# EAGLE design room-therm (EAGLE 7.6.0)
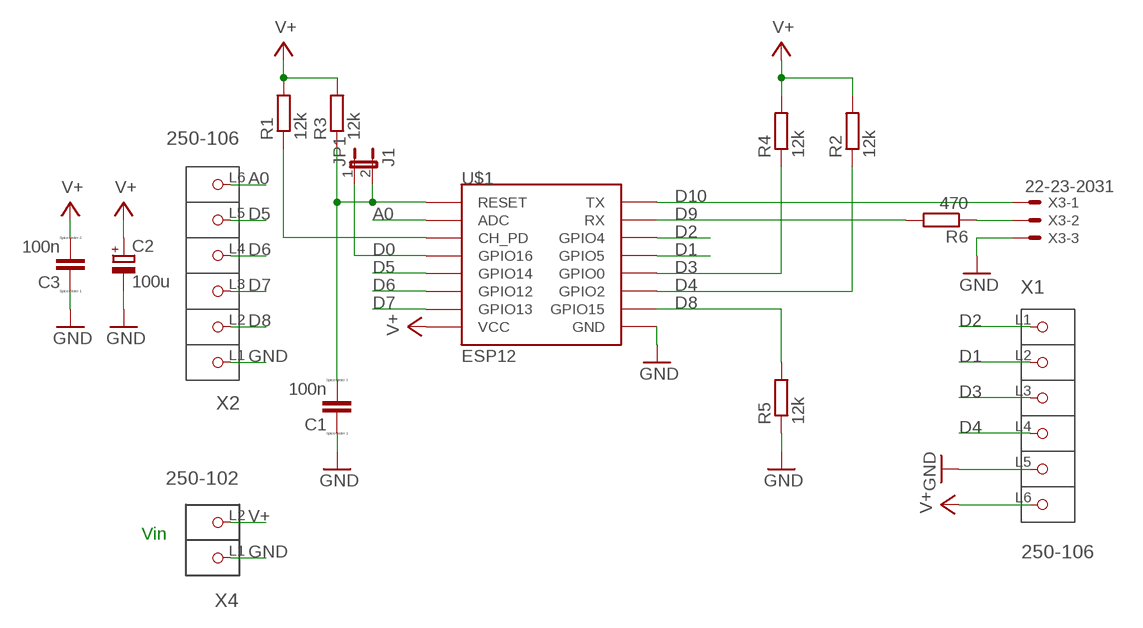
[diagram p0: schematic, sheet 1]

## Parts
C1  100n  CC1005  [C1005]
C2  100u  CPOL-EUE2-4  [E2-4]
C3  100n  CC1005  [C1005]
JP1  J1  JP1E  [JP1]
R1  12k  R-EU_R0805  [R0805]
R2  12k  R-EU_R0805  [R0805]
R3  12k  R-EU_R0805  [R0805]
R4  12k  R-EU_R0805  [R0805]
R5  12k  R-EU_R0805  [R0805]
R6  470  R-EU_R0805  [R0805]
U$1  ESP12  [ESP12]
X1  250-106  [P-250-106]
X2  250-106  [P-250-106]
X3  22-23-2031  [22-23-2031]
X4  250-102  [P-250-102]

## Nets
A0: U$1.ADC X2.L6(P6)
D0: JP1.1 U$1.GPIO16
D1: U$1.GPIO5 X1.L2(P2)
D2: U$1.GPIO4 X1.L1(P1)
D3: R4.1 U$1.GPIO0 X1.L3(P3)
D4: R2.1 U$1.GPIO2 X1.L4(P4)
D5: U$1.GPIO14 X2.L5(P5)
D6: U$1.GPIO12 X2.L4(P4)
D7: U$1.GPIO13 X2.L3(P3)
D8: R5.2 U$1.GPIO15 X2.L2(P2)
D9: R6.2 U$1.RX
D10: U$1.TX X3.1
GND: C1.1 C2.- C3.1 R5.1 U$1.GND X1.L5(P5) X2.L1(P1) X3.3 X4.L1(P1)
N$3: C1.2 JP1.2 R3.1 U$1.RESET
N$4: R1.1 U$1.CH_PD
N$7: R6.1 X3.2
V+: C2.+ C3.2 R1.2 R2.2 R3.2 R4.2 U$1.VCC X1.L6(P6) X4.L2(P2)

## Notes on the sheet
- Vin

## Library data of the parts
C1 C3 = eagle-ltspice:C: CAPACITOR, European symbol; SPICEMODEL: NONE; SPICEPREFIX: C
C2 = resistor:CPOL-EU: POLARIZED CAPACITOR, European symbol
JP1 = jumper:JP1E: JUMPER
R1-R6 = rcl:R-EU_: RESISTOR, European symbol
U$1 = esp8266modules:ESP12: ESP8266 Wifi module 12
X1 X2 = con-wago_250:250-106: Serie 250, 1-Leiter-Klemmenleiste für Leiterplatten 1 Lötstift/Pol vorn / Series 250, 1-conductor PCB terminal strip 1 front solder pin/pole Polzahl / Pole No.: 6 Rastermaß / Pitch: 3.5 mm Bemessungsspannung / Rated Voltage: 160 V Nennstrom / Nominal Current: 8 A Leiterquerschnitt / Conductor Size: 0.2 - 1.5 mm² Anschlusstechnik / Connection Technology: Steckklemm-Anschluss Lötstiftlänge: / Solder Pin Length: 3.6 mm Leitereinführung (zur Platine) / Conductor entry angle (to PCB): 45 ° Farbe / Color: grau / gray Stand: 01.01.2012. Die jeweils aktuellen Daten zu diesem Artikel finden Sie in unserem Produktkatalog, den Sie unter www.wago.com einsehen können. As of: 01/01/2012. Please find the newest data for this article in our product catalogue, which can be viewed under www.wago.com.
X3 = con-molex:22-23-2031: .100" (2.54mm) Center Header - 3 Pin; MF: MOLEX; MPN: 22-23-2031; OC_FARNELL: 1462950; OC_NEWARK: 30C0862
X4 = con-wago_250:250-102: Serie 250, 1-Leiter-Klemmenleiste für Leiterplatten 1 Lötstift/Pol vorn / Series 250, 1-conductor PCB terminal strip 1 front solder pin/pole Polzahl / Pole No.: 2 Rastermaß / Pitch: 3.5 mm Bemessungsspannung / Rated Voltage: 160 V Nennstrom / Nominal Current: 8 A Leiterquerschnitt / Conductor Size: 0.2 - 1.5 mm² Anschlusstechnik / Connection Technology: Steckklemm-Anschluss Lötstiftlänge: / Solder Pin Length: 3.6 mm Leitereinführung (zur Platine) / Conductor entry angle (to PCB): 45 ° Farbe / Color: grau / gray Stand: 01.01.2012. Die jeweils aktuellen Daten zu diesem Artikel finden Sie in unserem Produktkatalog, den Sie unter www.wago.com einsehen können. As of: 01/01/2012. Please find the newest data for this article in our product catalogue, which can be viewed under www.wago.com.

## Board
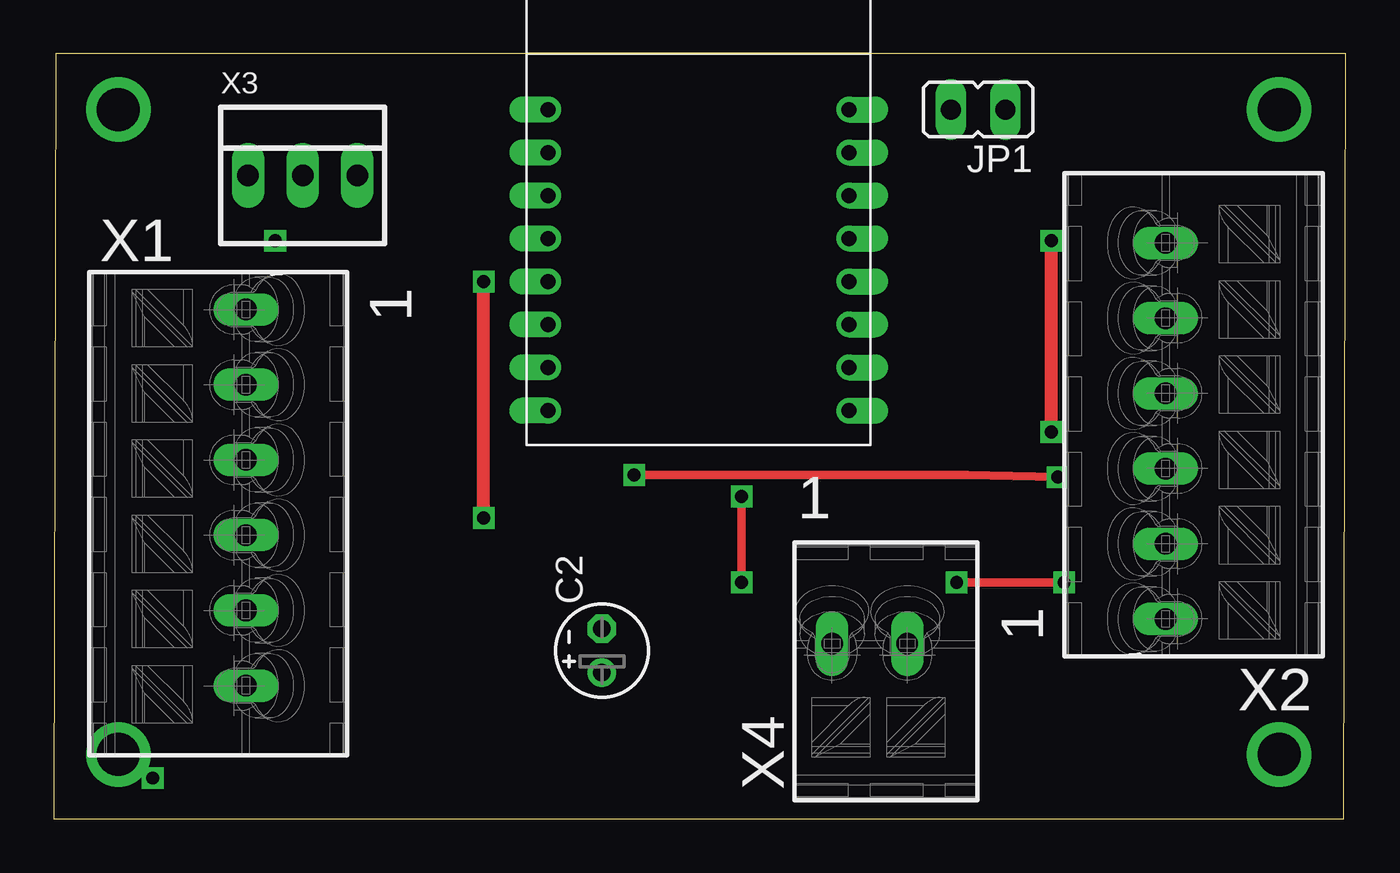
[diagram p1: board, top side]
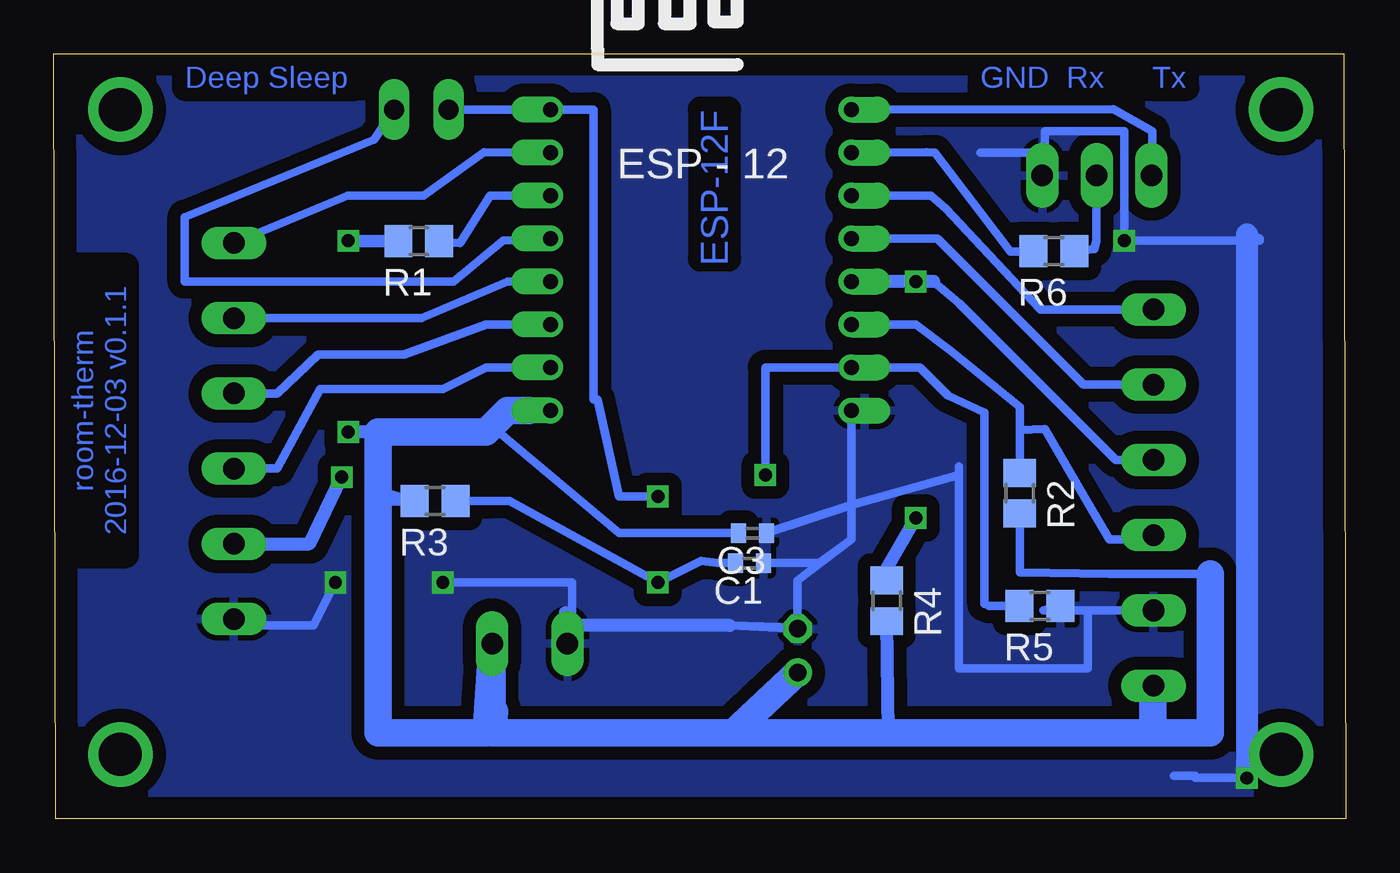
[diagram p2: board, bottom side, seen from below]

Size 60.1 x 35.6 mm. Coordinates in mm from the lower left corner, seen from the top.
Outline: 0,0 60,0 60.1,35.6 0.1,35.6 0,0
Copper layers (1*16): Top 0.035mm / dielectric 1.5mm / Bottom 0.035mm
Design rules "default *": minimum track width 10mil, minimum drill 0.5mm, track to track 8mil, track to pad 8mil, pad to pad 8mil, via to via 8mil, smd to smd 8mil, copper to edge 40mil, drill to drill 8mil, minimum pad ring 10mil, minimum via ring 8mil, stop-mask expansion 4mil, vias tented up to drill 0mil, thermal gap 10mil

### Footprints (pad centres in the part's own frame; a part is rotated, then mirrored left to right if it is on the bottom)
C1005 = smd 0.7 x 0.9: 1 -0.65,0; 2 0.65,0
E2-4 = drill 0.813 pad 1.27: + -1.016,0 | drill 0.813 pad 1.27 octagon: - 1.016,0
JP1 = drill 0.914 long: 1 0,-1.27; 2 0,1.27
R0805 = smd 1.3 x 1.5: 1 -0.95,0; 2 0.95,0
ESP12 = drill 0.7 offset: ADC -7.1,3.8; CH_PD -7.1,1.8; GND 6.9,-8.2; GPIO0 6.9,-2.2; GPIO2 6.9,-4.2; GPIO4 6.9,1.8; GPIO5 6.9,-0.2; GPIO12 -7.1,-4.2; GPIO13 -7.1,-6.2; GPIO14 -7.1,-2.2; GPIO15 6.9,-6.2; GPIO16 -7.1,-0.2; RESET -7.1,5.8; RX 6.9,3.8; TX 6.9,5.8; VCC -7.1,-8.2
P-250-106 = drill 1 long: L1 1.3,9.5; L2 1.3,6; L3 1.3,2.5; L4 1.3,-1; L5 1.3,-4.5; L6 1.3,-8
22-23-2031 = drill 1 long: 1 -2.54,0; 2 0,0; 3 2.54,0
P-250-102 = drill 1 long: L1 1.3,2.5; L2 1.3,-1

### Placement (x,y rotation side)
C1  27.74,11.9 180 bottom
C2  25.5,7.83 90 top
C3  27.6,13.3 180 bottom
JP1  43,33 90 top
R1  43.12,26.88 180 bottom
R2  15.17,15.15 270 bottom
R3  42.36,14.79 180 bottom
R4  21.36,10.15 270 bottom
R5  14.23,9.91 180 bottom
R6  13.58,26.42 180 bottom
U$1  29.9,27.2 0 bottom
X1  7.64,14.2 0 top
X2  53.02,18.8 180 top
X3  11.58,29.93 0 top
X4  38.71,6.86 90 top

### Tracks (layer width: path | path; a pad name or v marks a point on that pad's centre or on a via)
A0
  Bottom 0.406: U$1.ADC 40.09,31.01 42.9,29 46.42,29 X2.L6
D0
  Bottom 0.406: U$1.GPIO16 39.2,26.9 41.5,25 54,25 54,28 45.2,31.6 JP1.1
D1
  Bottom 0.406: X1.L2 12.2,20.2 19,27 U$1.GPIO5
D2
  Bottom 0.406: X1.L1 14.2,23.7 18.6,28.4 19.3,29 U$1.GPIO4
D3  (via drill 0.6)
  Top 0.61: v20,14 v20,25
  Bottom 0.406: X1.L3 10.7,16.7 18,24 19.17,25 | R4.1 21.36,11.64
  Bottom 0.61: 21.36,11.64 v20,14 | U$1.GPIO0 v20,25 19.17,25
D4
  Bottom 0.406: X1.L4 8.94,13.06 9,13 11,13 12,14.7 14,18.13 15.17,18.1 | R2.1 15.17,18.1 | 15.17,18.1 15.17,19.17 18.4,21.8 20,23 U$1.GPIO2
D5
  Bottom 0.406: X2.L5 43,23.3 39,25 U$1.GPIO14
D6
  Bottom 0.406: U$1.GPIO12 40,23 43.8,21.6 47.8,21.6 49.7,19.8 X2.L4
D7
  Bottom 0.406: U$1.GPIO13 40,21 42,20 47.7,20 49.7,16.3 X2.L3
D8  (via drill 0.6)
  Top 0.406: v27,16 42.5,16 v46.7,15.9
  Bottom 0.406: R5.2 16.61,9.91 16.8,10 16.8,18.9 18.5,19.7 19.8,21 U$1.GPIO15 27,21 v27,16
  Bottom 0.61: X2.L2 48.2,12.8 v46.7,15.9
D9
  Bottom 0.406: U$1.RX 19.51,31.01 19.1,31 15.6,26.4 14.6,26.4 14.95,26 R6.2
D10
  Bottom 0.406: U$1.TX 10.81,33.01 9,32 9,29.97 X3.1
GND  (via drill 0.6)
  Top 0.406: v42,11 v47,11
  Bottom 0.406: X1.L5 12,9.7 | 12,9.7 14.07,9.7 R5.1 | 12,9.7 12,7 18,7 18,16 | C3.1 23,14.6 | 23,14.6 18,16 | 18,16 18,16.39 | 23,13 23,14.6 | C2.- 28.65,9 25.5,8.9 25.5,11.1 23,13 | C1.1 24.5,11.9 23,13 | 14,31 X3.3 | U$1.GND 23,14.6 | 36.3,9.6 36,9.6 36,11 v42,11 | v47,11 48,9 51.72,9 X2.L1 | 17,31 14,31 | 14,31 14,32 10.3,32 v10.3,26.9 4,26.9 4,27 4.6,27.2 | v4.6,1.9 7,1.9 7,2 8,2
  Bottom 0.61: 28.65,9 36,9 36.3,9.6 X4.L1
  Bottom 1.016: 4.6,27.2 v4.6,1.9
  pour Bottom (isolate 0.61): 1,35 1,1 59,1 59,35
N$1  (via drill 2 pad 1.68)
  other vias: 57,33
N$2  (via drill 2 pad 1.27)
  other vias: 3,33
N$3  (via drill 0.6)
  Top 0.406: v32,15 v32,11
  Bottom 0.406: U$1.RESET JP1.2 | JP1.2 40,33 | C1.2 29.2,11.9 30,12 v32,11 38.9,14.8 39.7,14.8 | 39.9,14.8 39.7,14.8 | 39.7,14.8 R3.1 | JP1.2 35,33 35,19.5 34.8,19.5 33.8,15 v32,15
N$4
  Bottom 0.406: U$1.CH_PD 39.8,29 41.2,26.8 41.8,26.81 R1.1
N$5  (via drill 2 pad 2.54)
  other vias: 57,3
N$6  (via drill 2 pad 1.27)
  other vias: 3,3
N$7
  Bottom 0.406: R6.1 12.58,26.42 11.7,26.5 11.6,26.9 X3.2
V+  (via drill 0.6)
  Top 0.61: v46.4,18 v46.4,26.9
  Bottom 0.406: X4.L2 39.61,8.61 39.6,5 | R2.2 15.17,11.47 11,11.4 6.3,11.4 | 9,5 9,6.14 X1.L6 | R3.2 44.7,15.2 | C3.2 33.8,13.3 39.4,18 40,18 | U$1.VCC 38,19
  Bottom 0.61: R4.2 21.3,4 | R3.2 45,14.9 45,18 v46.4,18 | v46.4,26.9 R1.2
  Bottom 1.27: 28.5,4 39.7,4 | 39.7,4 39.6,5 | C2.+ 28.5,4 | 28.5,4 21.3,4 9,4 | 39.7,4 X4.L2 40,4 45,4 45,18 40,18 39,19 38,19 | X1.L6 9,4 | 9,4 6.3,4 6.3,11.4

### Text on the board
Bottom: Tx | Rx | GND | Deep Sleep | ESP-12F | room-therm / 2016-12-03 v0.1.1